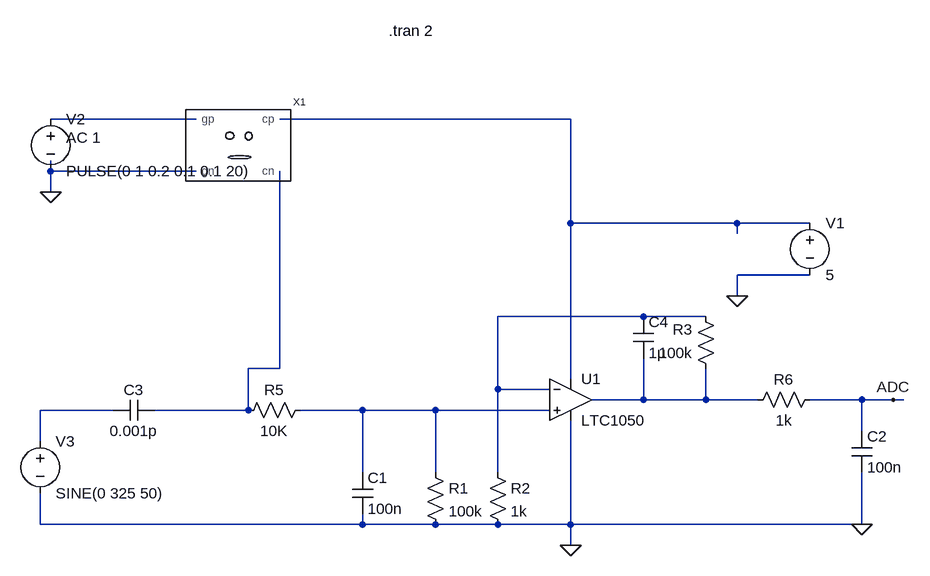
[diagram p0: schematic Circuit Capteur complet avec bruit.asc]
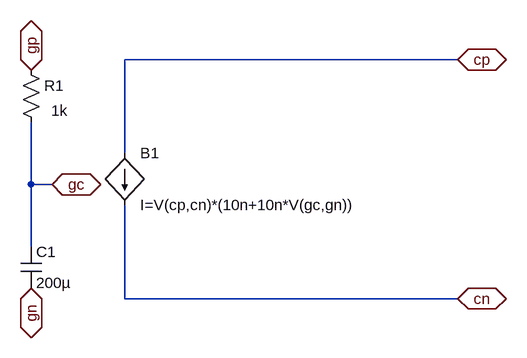
[diagram p1: sub-circuit symbolique.asc]
Circuit Capteur complet avec bruit.asc, the LTspice schematic file:
Version 4
SHEET 1 1272 680
WIRE 160 -416 -64 -416
WIRE 736 -416 288 -416
WIRE -64 -336 -64 -352
WIRE 160 -336 -64 -336
WIRE -64 -304 -64 -336
WIRE 736 -256 736 -416
WIRE 992 -256 736 -256
WIRE 1104 -256 992 -256
WIRE 992 -240 992 -256
WIRE 1104 -176 992 -176
WIRE 992 -144 992 -176
WIRE 848 -112 624 -112
WIRE 944 -112 848 -112
WIRE 288 -32 288 -336
WIRE 288 -32 240 -32
WIRE 736 -16 736 -256
WIRE 624 0 624 -112
WIRE 704 0 624 0
WIRE 848 16 848 -48
WIRE 848 16 768 16
WIRE 944 16 944 -32
WIRE 944 16 848 16
WIRE 1024 16 944 16
WIRE 1184 16 1104 16
WIRE 1232 16 1184 16
WIRE 1248 16 1232 16
WIRE 32 32 -80 32
WIRE 240 32 240 -32
WIRE 240 32 96 32
WIRE 416 32 320 32
WIRE 528 32 416 32
WIRE 704 32 528 32
WIRE 1184 64 1184 16
WIRE -80 80 -80 32
WIRE 416 128 416 32
WIRE 528 128 528 32
WIRE 624 128 624 0
WIRE -80 208 -80 160
WIRE 416 208 416 192
WIRE 416 208 -80 208
WIRE 528 208 416 208
WIRE 624 208 528 208
WIRE 736 208 736 48
WIRE 736 208 624 208
WIRE 1184 208 1184 128
WIRE 1184 208 736 208
WIRE 736 240 736 208
FLAG 736 240 0
FLAG 992 -144 0
FLAG 1184 208 0
FLAG 1232 16 ADC
FLAG -64 -304 0
SYMBOL res 336 16 R90
WINDOW 0 0 56 VBottom 2
WINDOW 3 32 56 VTop 2
SYMATTR InstName R5
SYMATTR Value 10K
SYMATTR SpiceLine tol=1 pwr=0.1
SYMBOL cap 400 128 R0
SYMATTR InstName C1
SYMATTR Value 100n
SYMBOL res 512 112 R0
SYMATTR InstName R1
SYMATTR Value 100k
SYMBOL res 608 112 R0
SYMATTR InstName R2
SYMATTR Value 1k
SYMBOL OpAmps\\LTC1050 736 -48 R0
SYMATTR InstName U1
SYMBOL res 1120 0 R90
WINDOW 0 0 56 VBottom 2
WINDOW 3 32 56 VTop 2
SYMATTR InstName R6
SYMATTR Value 1k
SYMBOL res 960 -16 R180
WINDOW 0 36 76 Left 2
WINDOW 3 36 40 Left 2
SYMATTR InstName R3
SYMATTR Value 100k
SYMBOL cap 832 -112 R0
SYMATTR InstName C4
SYMATTR Value 1µ
SYMBOL cap 1168 64 R0
SYMATTR InstName C2
SYMATTR Value 100n
SYMBOL voltage 1104 -272 R0
WINDOW 123 0 0 Left 0
WINDOW 39 0 0 Left 0
SYMATTR InstName V1
SYMATTR Value 5
SYMBOL Symbolique 224 -368 R0
SYMATTR InstName X1
SYMBOL voltage -64 -432 R0
WINDOW 123 24 44 Left 2
WINDOW 39 0 0 Left 0
SYMATTR Value2 AC 1
SYMATTR InstName V2
SYMATTR Value PULSE(0 1 0.2 0.1 0.1 20)
SYMBOL cap 96 16 R90
WINDOW 0 0 32 VBottom 2
WINDOW 3 32 32 VTop 2
SYMATTR InstName C3
SYMATTR Value 0.001p
SYMBOL voltage -80 64 R0
WINDOW 123 0 0 Left 0
WINDOW 39 0 0 Left 0
SYMATTR InstName V3
SYMATTR Value SINE(0 325 50)
TEXT 456 -552 Left 2 !.tran 2

symbolique.asc, the sub-circuit schematic file:
Version 4
SHEET 1 880 680
WIRE 608 -48 96 -48
WIRE 96 96 96 -48
WIRE -48 144 -48 48
WIRE -16 144 -48 144
WIRE -48 240 -48 144
WIRE 96 320 96 176
WIRE 608 320 96 320
FLAG 608 -48 cp
IOPIN 608 -48 BiDir
FLAG 608 320 cn
IOPIN 608 320 BiDir
FLAG -48 -32 gp
IOPIN -48 -32 BiDir
FLAG -48 304 gn
IOPIN -48 304 BiDir
FLAG -16 144 gc
IOPIN -16 144 BiDir
SYMBOL bi 96 96 R0
SYMATTR InstName B1
SYMATTR Value I=V(cp,cn)*(10n+10n*V(gc,gn))
SYMBOL res -64 -48 R0
WINDOW 3 47 78 Left 2
SYMATTR InstName R1
SYMATTR Value 1k
SYMBOL cap -64 240 R0
SYMATTR InstName C1
SYMATTR Value 200µ

The netlist it stands for:
* Circuit Capteur complet avec bruit.asc
R5 N007 N004 10K tol=1 pwr=0.1
C1 N007 0 100n
R1 N007 0 100k
R2 N003 0 1k
XU1 N007 N003 N002 0 N005 LTC1050  ; pins In+ In- V+ V- OUT
R6 ADC N005 1k
R3 N005 N003 100k
C4 N003 N005 1µ
C2 ADC 0 100n
V1 N002 0 5
XX1 N002 N004 N001 0 symbolique
V2 N001 0 PULSE(0 1 0.2 0.1 0.1 20) AC 1
C3 N004 N006 0.001p
V3 N006 0 SINE(0 325 50)

* block symbol definitions
.subckt symbolique cp cn gp gn
B1 cp cn I=V(cp,cn)*(10n+10n*V(gc,gn))
R1 gp gc 1k
C1 gc gn 200µ
.ends symbolique

.tran 2
.lib LTC.lib
.backanno
.end